# Altium schematic sheet PWR.SchDoc
size A; SheetNumber: 4; SheetTotal: 5
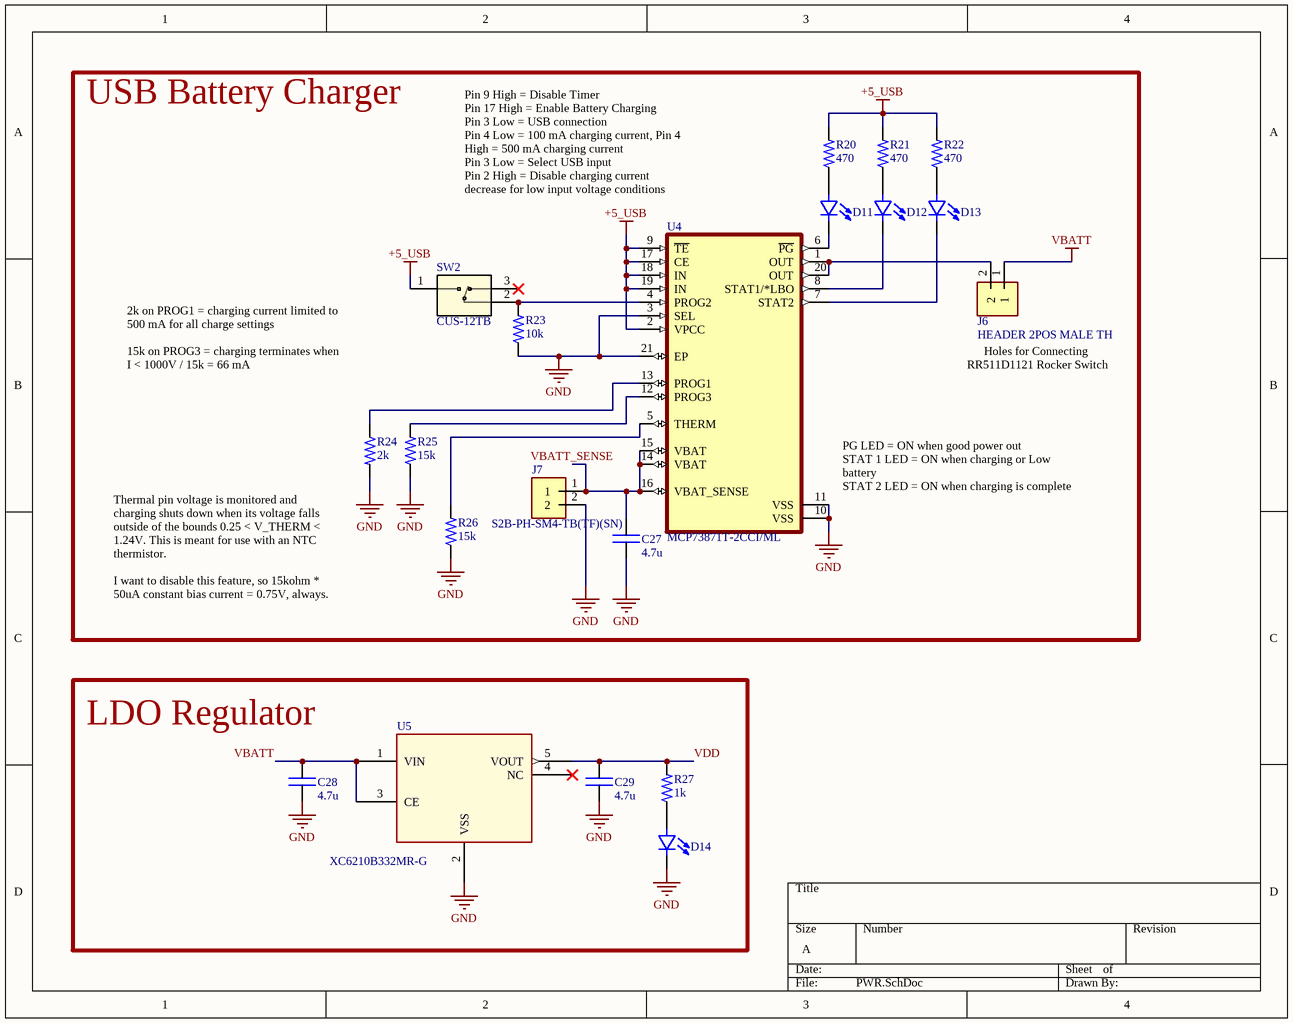
[diagram p0: PWR.SchDoc]

## Parts
C27  value 4.7u  [0603-CAP]  (hidden comment: CAP)
C28  value 4.7u  [0603-CAP]  (hidden comment: CAP)
C29  value 4.7u  [0603-CAP]  (hidden comment: CAP)
D11  LED - single  [0603-LED]  (value not drawn)
D12  LED - single  [0603-LED]  (value not drawn)
D13  LED - single  [0603-LED]  (value not drawn)
D14  LED - single  [0603-LED]  (value not drawn)
J6  HEADER 2POS MALE TH  [2-pos, 0.1" TH header]
J7  S2B-PH-SM4-TB(TF)(SN)  [JST_PH-2POS-SMT-RA]
R20  value 470  [0603-RES]  (hidden comment: RES)
R21  value 470  [0603-RES]  (hidden comment: RES)
R22  value 470  [0603-RES]  (hidden comment: RES)
R23  value 10k  [0603-RES]  (hidden comment: RES)
R24  value 2k  [0603-RES]  (hidden comment: RES)
R25  value 15k  [0603-RES]  (hidden comment: RES)
R26  value 15k  [0603-RES]  (hidden comment: RES)
R27  value 1k  [0603-RES]  (hidden comment: RES)
SW2  CUS-12TB  [SSSS811101]
U4  MCP73871T-2CCI/ML  [20-VFQFN EXPOSED PAD]
U5  XC6210B332MR-G  [SOT-25-5]

## Blocks framed on the sheet
USB Battery Charger: C27 D11-D13 J6 J7 R20-R26 SW2 U4
LDO Regulator: C28 C29 D14 R27 U5

## Nets
+5_USB: R20.2 R21.2 R22.2 SW2.1 U4.2(VPCC) U4.9(~{TE}) U4.17(CE) U4.18(IN) U4.19(IN)
GND: C27.2 C28.1 C29.2 D14.2(C) J7.2 R23.1 R24.2 R25.1 R26.1 U4.3(SEL) U4.10(VSS) U4.11(VSS) U4.21(EP) U5.2(VSS)
VBATT: C28.2 J6.1 U5.1(VIN) U5.3(CE)
VBATT_SENSE: C27.1 J7.1 U4.14(VBAT) U4.15(VBAT) U4.16(VBAT_SENSE)
VDD: C29.1 R27.2 U5.5(VOUT)
NetD11_1: D11.1(A) R20.1
NetD11_2: D11.2(C) U4.6(~{PG})
NetD12_1: D12.1(A) R21.1
NetD12_2: D12.2(C) U4.8(STAT1/*LBO)
NetD13_1: D13.1(A) R22.1
NetD13_2: D13.2(C) U4.7(STAT2)
NetD14_1: D14.1(A) R27.1
NetJ6_2: J6.2 U4.1(OUT) U4.20(OUT)
NetR23_2: R23.2 SW2.2 U4.4(PROG2)
NetR24_1: R24.1 U4.13(PROG1)
NetR25_2: R25.2 U4.12(PROG3)
NetR26_2: R26.2 U4.5(THERM)

Not connected (* = marked no-connect by the designer): SW2 3*; U5 4(NC)*

## Notes on the sheet
- Pin 9 High = Disable Timer
  Pin 17 High = Enable Battery Charging
  Pin 3 Low = USB connection
  Pin 4 Low = 100 mA charging current, Pin 4 High = 500 mA charging current
  Pin 3 Low = Select USB input
  Pin 2 High = Disable charging current decrease for low input voltage conditions
- 2k on PROG1 = charging current limited to 500 mA for all charge settings
  15k on PROG3 = charging terminates when I < 1000V / 15k = 66 mA
- Holes for Connecting
  RR511D1121 Rocker Switch
- (near U4) PG LED = ON when good power out
  STAT 1 LED = ON when charging or Low battery
  STAT 2 LED = ON when charging is complete
- (near R24) Thermal pin voltage is monitored and charging shuts down when its voltage falls outside of the bounds 0.25 < V_THERM < 1.24V. This is meant for use with an NTC thermistor.
  I want to disable this feature, so 15kohm * 50uA constant bias current = 0.75V, always.

## Library data of the parts
C27-C29 = CAP: Capaicitor; Type: SMD; MFR: *; MFR PN: *
D11 = LED - single: LED; MFR: MEIHUA; MFR PN: MHT192WDT-GOLD; Color: Yellow; Type: SMD
D12 = LED - single: LED; MFR: Hubei KENTO Elec; MFR PN: KT-0603R; Color: Red; Type: SMD
D13 D14 = LED - single: LED; MFR: Everlight Elec; MFR PN: 19-217/GHC-YR1S2/3T; Color: Green; Type: SMD
J6 = HEADER 2POS MALE TH: Value: DNS
J7 = JST CONN 2POS PH: Connector Header Surface Mount, Right Angle 2 position 0.079 (2.00mm); MFR: JST Sales; MFR PN: S2B-PH-SM4-TB(TF)(SN); Type: SMD
R20-R27 = RES: Resistor; MFR PN: *; MFR: *; Type: SMD
SW2 = SPDT SLIDE SWITCH: JLC Alternate: / SSSS811101; MFR: ALPSALPINE; MFR PN: SSSS811101; Type: SMD
U4 = LiPo Batt Charger - Shared load: Charger IC Lithium Ion/Polymer 20-QFN (4x4); MFR: Microchip Technology; Type: SMD; MFR PN: MCP73871T-2CCI/ML
U5 = LDO 3.3V FIXED 700mA: No Description Available; MFR: Torex Semiconductor; MFR PN: XC6210B332MR-G; Type: SMD